# EAGLE design 2in-2out_1.0a (EAGLE 5.02)
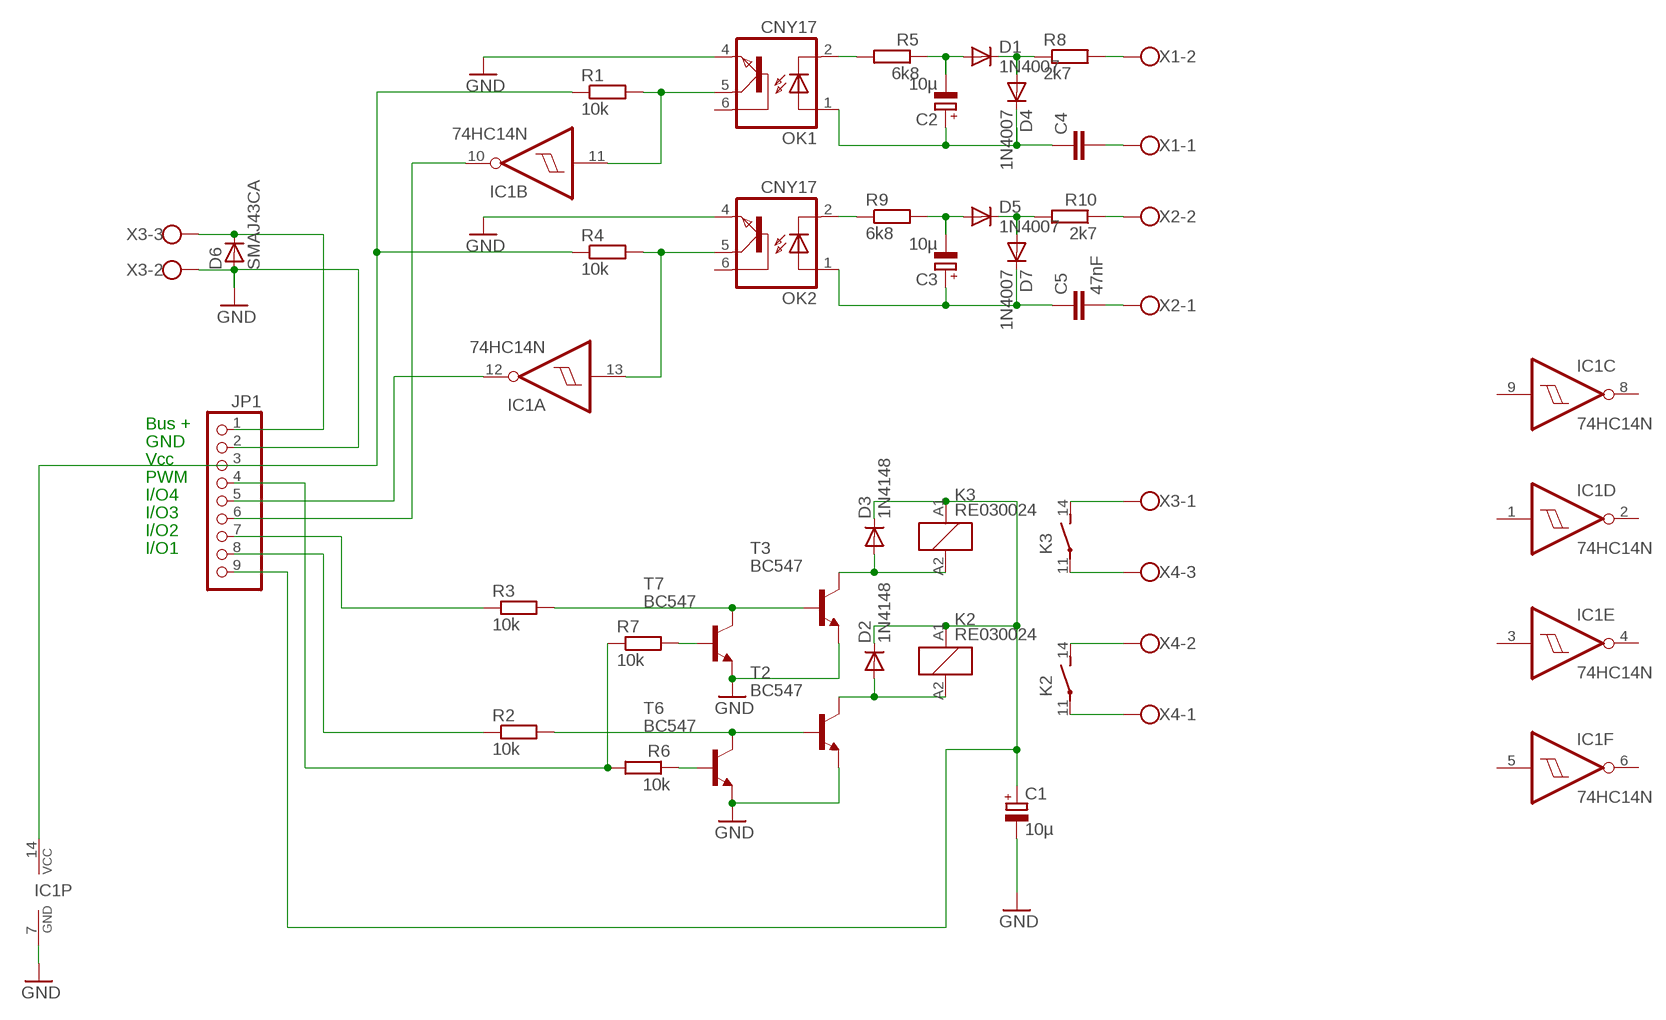
[diagram p0: schematic, sheet 1]

## Parts
C1  10µ  CPOL-EUE3.5-8  [E3,5-8]
C2  10µ  CPOL-EUE2-4  [E2-4]
C3  10µ  CPOL-EUE2-4  [E2-4]
C4  C-EU075-063X106  [C075-063X106]
C5  47nF  C-EU075-063X106  [C075-063X106]
D1  1N4007  DIODE-D-2.5  [D-2.5]
D2  1N4148  1N4148STEHEND  [D-2.5]
D3  1N4148  1N4148STEHEND  [D-2.5]
D4  1N4007  DIODE-D-2.5  [D-2.5]
D5  1N4007  DIODE-D-2.5  [D-2.5]
D6  SMAJ43CA  D-SMB  [SMB]
D7  1N4007  DIODE-D-2.5  [D-2.5]
IC1  74HC14N  [DIL14]
JP1  PINHD-1X9  [1X09]
K2  RE030024  [RE-SCHRACK]
K3  RE030024  [RE-SCHRACK]
OK1  CNY17  [DIL06]
OK2  CNY17  [DIL06]
R1  10k  R-EU_0207/7  [0207/7]
R2  10k  R-EU_0207/2V  [0207/2V]
R3  10k  R-EU_0207/2V  [0207/2V]
R4  10k  R-EU_0207/2V  [0207/2V]
R5  6k8  R-EU_0207/2V  [0207/2V]
R6  10k  R-EU_0207/2V  [0207/2V]
R7  10k  R-EU_0207/2V  [0207/2V]
R8  2k7  R-EU_0207/2V  [0207/2V]
R9  6k8  R-EU_0207/2V  [0207/2V]
R10  2k7  R-EU_0207/2V  [0207/2V]
T2  BC547  [TO92]
T3  BC547  [TO92]
T6  BC547  [TO92]
T7  BC547  [TO92]
X1  W237-02P  [W237-132]
X2  W237-02P  [W237-132]
X3  W237-3E  [W237-3E]
X4  W237-3E  [W237-3E]

## Nets
GND: C1.- D6.2(A) IC1.7(P:GND) JP1.2 OK1.4(EMI) OK2.4(EMI) T2.1(E) T3.1(E) T6.1(E) T7.1(E) X3.2
IO1: JP1.8 R2.1
IO2: JP1.7 R3.1
IO3: IC1.10(B:O) JP1.6
IO4: IC1.12(A:O) JP1.5
N$1: OK1.2(C) R5.2
N$2: K3.14(2:S) X3.1
N$3: C2.- D1.A R5.1
N$4: D6.1(C) JP1.1 X3.3
N$5: D1.C D4.A R8.1
N$6: R8.2 X1.2
N$7: K3.11(2:P) X4.3
N$8: K2.14(2:S) X4.2
N$9: K2.11(2:P) X4.1
N$10: OK2.2(C) R9.1
N$11: C5.2 X2.1
N$12: JP1.4 R6.2 R7.1
N$13: C3.- D5.A R9.2
N$14: R3.2 T3.2(B) T7.3(C)
N$15: C4.2 X1.1
N$17: R2.2 T2.2(B) T6.3(C)
N$18: D5.C D7.A R10.2
N$19: D2.A K2.A2 T2.3(C)
N$20: C3.+ C5.1 D7.C OK2.1(A)
N$21: R7.2 T7.2(B)
N$22: R6.1 T6.2(B)
N$23: R10.1 X2.2
N$24: C2.+ C4.1 D4.C OK1.1(A)
N$28: IC1.13(A:I) OK2.5(COL) R4.2
N$29: IC1.11(B:I) OK1.5(COL) R1.2
N$30: IC1.14(P:VCC) JP1.3 R1.1 R4.1
R3: D3.A K3.A2 T3.3(C)
VDD_IN: C1.+ D2.C D3.C JP1.9 K2.A1 K3.A1
Unconnected: IC1.1(D:I) IC1.2(D:O) IC1.3(E:I) IC1.4(E:O) IC1.5(F:I) IC1.6(F:O) IC1.8(C:O) IC1.9(C:I) OK1.6(BAS) OK2.6(BAS)

## Notes on the sheet
- Bus +
- GND
- Vcc
- PWM
- I/O4
- I/O3
- I/O2
- I/O1

## Library data of the parts
C1-C3 = rcl:CPOL-EU: POLARIZED CAPACITOR, European symbol
C4 C5 = rcl:C-EU: CAPACITOR, European symbol
D1 D4 D5 D7 = diode:DIODE-: DIODE
D2 D3 = diode:1N4148: DIODE high speed (Philips)
D6 = semicon-smd-ipc:D-: DIODE unfilled
IC1 = 74xx-eu:74*14: Hex schmitt trigger INVERTER
JP1 = pinhead:PINHD-1X9: PIN HEADER
K2 K3 = relay:RE03*: Miniature PCB Relay 1 pole 6 A SCHRACK Source: http://www.schrack.com/.. 5812.pdf
OK1 OK2 = optocoupler:CNY17: SIEMENS OPTO COUPLER
R1-R10 = rcl:R-EU_: RESISTOR, European symbol
T2 T3 T6 T7 = transistor-npn:BC547*: NPN Transistor
X1 X2 = con-wago-508:W237-02P: WAGO SREW CLAMP
X3 X4 = con-wago-508:W237-3E: WAGO SREW CLAMP

## Board
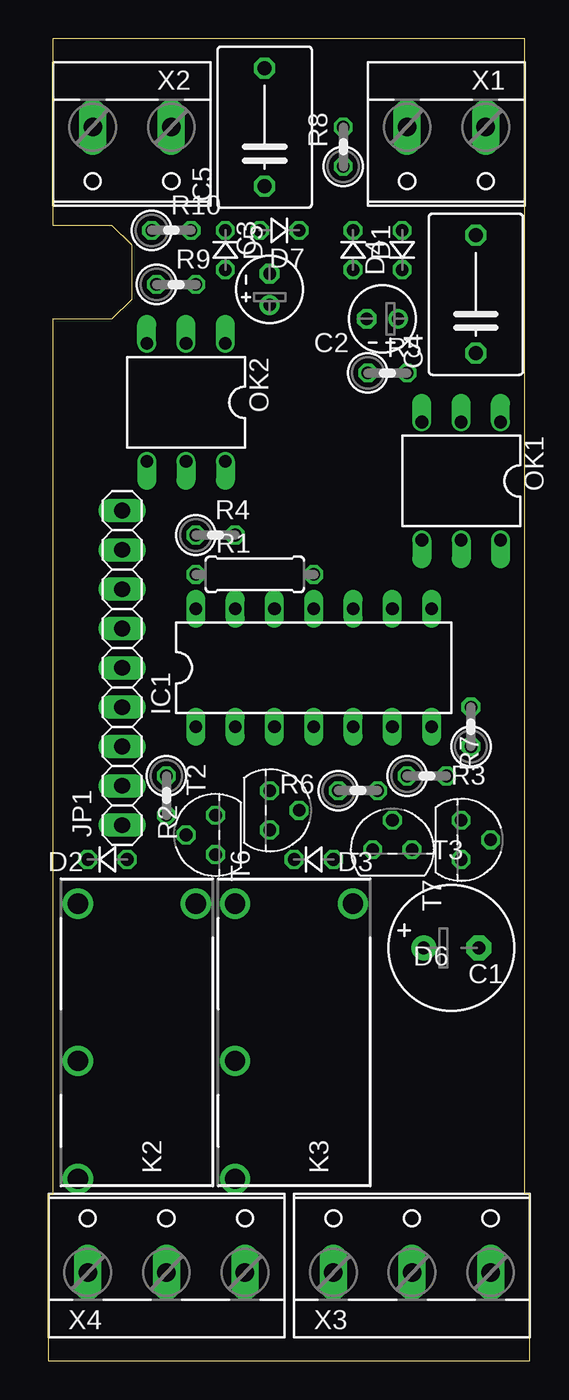
[diagram p1: board, top side]
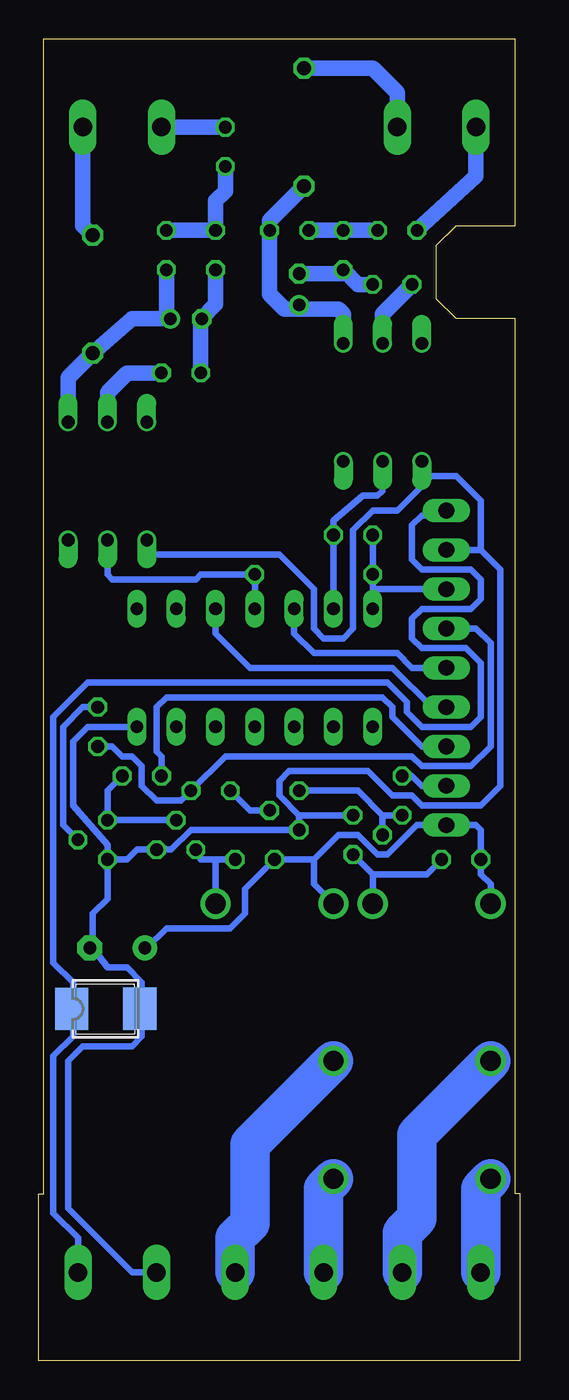
[diagram p2: board, bottom side, seen from below]

Size 31.11 x 85.41 mm. Coordinates in mm from the lower left corner, seen from the top.
Outline: 0,0 0,10.79 0.32,10.79 0.32,67.31 4.13,67.31 5.4,68.58 5.4,72.07 4.13,73.34 0.32,73.34 0.32,85.41 30.8,85.41 30.8,10.79 31.11,10.79 31.11,0 0,0
Copper layers (1*16): Top 0.035mm / dielectric 1.5mm / Bottom 0.035mm
Design rules "ZWILLING": minimum track width 0.2mm, minimum drill 0.5mm, track to track 0.2mm, track to pad 0.2mm, pad to pad 0.2mm, via to via 0.2mm, smd to smd 0mil, copper to edge 0.2mm, drill to drill 0.2mm, minimum pad ring 0.2mm, minimum via ring 0.2mm, stop-mask expansion 0.1mm, vias tented up to drill 0mil, thermal gap 10mil

### Footprints (pad centres in the part's own frame; a part is rotated, then mirrored left to right if it is on the bottom)
E3,5-8 = drill 0.813 pad 1.6 round: + -1.778,0 | drill 0.813 pad 1.6 octagon: - 1.778,0
E2-4 = drill 0.813 pad 1.27 round: + -1.016,0 | drill 0.813 pad 1.27 octagon: - 1.016,0
C075-063X106 = drill 0.914 octagon: 1 -3.81,0; 2 3.81,0
D-2.5 = drill 0.813 octagon: A 1.27,0; C -1.27,0
SMB = smd 2.159 x 2.743: 1 -2.311,-0.127; 2 2.108,-0.102
DIL14 = drill 0.813 long: 1 -7.62,-3.81; 2 -5.08,-3.81; 3 -2.54,-3.81; 4 0,-3.81; 5 2.54,-3.81; 6 5.08,-3.81; 7 7.62,-3.81; 8 7.62,3.81; 9 5.08,3.81; 10 2.54,3.81; 11 0,3.81; 12 -2.54,3.81; 13 -5.08,3.81; 14 -7.62,3.81
1X09 = drill 1.016 long: 1 -10.16,0; 2 -7.62,0; 3 -5.08,0; 4 -2.54,0; 5 0,0; 6 2.54,0; 7 5.08,0; 8 7.62,0; 9 10.16,0
RE-SCHRACK = drill 1.3 round: 11 8.89,-3.81; 14 1.27,-3.81; A1 -8.89,-3.81; A2 -8.89,3.81
DIL06 = drill 0.813 offset: 1 -2.54,-3.81; 2 0,-3.81; 3 2.54,-3.81; 4 2.54,3.81; 5 0,3.81; 6 -2.54,3.81
0207/7 = drill 0.813 octagon: 1 -3.81,0; 2 3.81,0
0207/2V = drill 0.813 octagon: 1 -1.27,0; 2 1.27,0
TO92 = drill 0.813 octagon: 1 1.27,0; 2 0,1.905; 3 -1.27,0
W237-132 = drill 1.194 long: 1 -2.54,-0.635; 2 2.54,-0.635
W237-3E = drill 1.194 long: 1 -5.08,-0.635; 2 0,-0.635; 3 5.08,-0.635

### Placement (x,y rotation side)
C1  26.04,26.67 0 top
C2  21.59,67.31 180 top
C3  14.29,69.22 90 top
C4  27.62,68.9 90 top
C5  13.97,79.69 90 top
D1  19.68,71.75 270 top
D2  3.81,32.38 0 top
D3  17.14,32.38 0 top
D4  22.86,71.75 90 top
D5  11.43,71.75 270 top
D6  26.67,22.86 0 bottom
D7  14.92,73.02 180 top
IC1  17.14,44.77 0 top
JP1  4.76,44.77 270 top
K2  5.71,20.64 270 top
K3  15.88,20.64 270 top
OK1  26.67,56.83 180 top
OK2  8.89,61.91 180 top
R1  13.34,50.8 0 top
R2  7.62,36.51 270 top
R3  24.45,37.78 0 top
R4  10.79,53.34 0 top
R5  21.91,63.82 0 top
R6  20,36.83 0 top
R7  27.3,40.96 90 top
R8  19.05,78.42 90 top
R9  8.26,69.53 0 top
R10  7.94,73.02 0 top
T2  10.79,33.97 90 top
T3  22.22,33.02 0 top
T6  14.29,35.56 270 top
T7  26.67,33.66 270 top
X1  25.72,79.06 180 top
X2  5.4,79.06 180 top
X3  23.49,6.35 0 top
X4  7.62,6.35 0 top

### Tracks (layer width: path | path; a pad name or v marks a point on that pad's centre or on a via)
GND
  Bottom 0.406: 14.29,35.24 14.29,34.92 | 14.29,35.24 T2.1 | T7.1 25.4,32.38 24.77,33.02 T3.1 22.54,33.02 21.27,34.29 T6.1 14.29,35.24 | T7.1 26.67,33.34 28.89,35.88 28.89,40 27.94,40.96 IC1.7 | OK1.4 24.13,52.07 15.56,52.07 13.34,49.85 13.34,47.31 12.7,46.67 11.43,46.67 10.79,47.31 10.79,53.66 9.52,54.93 7.94,54.93 6.35,56.52 6.35,57.15 | 27.62,26.67 27.62,28.89 26.67,29.85 T7.1 | 6.35,57.15 4.13,57.15 2.54,55.56 2.54,52.39 | 2.54,52.39 JP1.2 | X3.2 25.08,5.71 29.21,9.84 29.21,19.37 28.26,20.32 25.08,20.32 24.45,20.96 24.45,23.08 | 24.45,23.08 D6.2 | 24.45,23.08 24.45,24.45 25.4,25.4 26.67,25.4 27.62,26.67 | 27.62,26.67 C1.- | 2.54,52.39 1.27,51.12 1.27,37.15 2.54,35.88 6.35,35.88 6.99,36.51 8.26,36.51 9.84,38.1 14.92,38.1 15.56,37.46 15.56,36.51 14.29,35.24 | 6.35,57.15 OK2.4
IO1
  Bottom 0.406: JP1.8 6.35,37.15 6.99,37.78 R2.1
IO2
  Bottom 0.406: R3.1 23.18,39.05 23.49,39.37 23.49,42.23 22.86,42.86 8.89,42.86 8.26,42.23 8.26,41.59 6.35,39.69 JP1.7
IO3
  Bottom 0.406: IC1.10 19.68,46.99 17.46,44.77 8.26,44.77 5.71,42.23 JP1.6
IO4
  Bottom 0.406: IC1.12 14.6,46.99 13.34,45.72 7.94,45.72 6.99,44.77 JP1.5
N$1
  Bottom 1.016: R5.2 25.4,63.82 26.67,62.55 OK1.2
N$2
  Bottom 2.54: X3.1 18.42,7.94 17.46,8.89 17.46,13.97 K3.14
N$3
  Bottom 0.406: 20.64,66.99 C2.-
  Bottom 1.016: R5.1 20.64,66.99 | C2.- 19.68,68.26 D1.A
N$4
  Bottom 0.406: X3.3 28.58,7.94 30.16,9.52 30.16,19.69 28.89,20.96 28.89,23.05 | 28.89,23.05 D6.1 | 28.89,23.05 28.89,24.45 30.16,25.72 30.16,41.59 27.94,43.81 8.57,43.81 7.3,42.54 7.3,41.91 6.35,40.96 3.17,40.96 2.54,41.59 2.54,45.08 3.49,46.04 6.35,46.04 6.99,46.67 6.99,47.94 6.35,48.58 3.17,48.58 2.54,49.21 2.54,50.48 3.17,51.12 6.35,51.12 6.99,51.75 6.99,53.97 6.35,54.61 4.76,54.61 JP1.1
N$5
  Bottom 1.016: R8.1 19.05,75.56 19.68,74.93 D1.C D4.A
N$6
  Bottom 1.016: R8.2 X1.2
N$7
  Bottom 2.54: X4.3 12.7,11.11 K3.11
N$8
  Bottom 2.54: X4.2 7.62,8.25 6.67,9.21 6.67,14.61 K2.14
N$9
  Bottom 2.54: X4.1 2.54,11.11 K2.11
N$10
  Bottom 1.016: OK2.2 8.89,67.63 R9.1
N$11
  Bottom 1.016: X2.1 7.94,81.91 9.52,83.5 C5.2
N$12
  Bottom 0.406: R7.1 26.35,39.69 25.72,39.05 25.08,39.05 24.45,38.42 24.45,37.15 23.49,36.2 21.91,36.2 R6.2 19.05,39.05 6.99,39.05 6.35,38.42 3.17,38.42 1.9,39.69 1.9,46.35 2.86,47.31 JP1.4
N$13
  Bottom 0.406: D5.A 11.43,70.23
  Bottom 1.016: 11.43,70.23 C3.- | R9.2 10.48,69.53 D5.A
N$14
  Bottom 0.406: R3.2 26.67,36.83 T7.3 T3.2
N$15
  Bottom 1.016: X1.1 28.26,73.34 C4.2
N$17
  Bottom 0.406: 8.89,35.24 10.48,36.83 T6.3 | 8.89,35.24 T2.2 | R2.2 8.89,35.24
N$18
  Bottom 1.016: R10.2 D5.C D7.A
N$19
  Bottom 0.406: D2.A 6.03,31.43 9.52,31.43 | 9.52,31.43 T2.3 | 9.52,31.43 K2.A2
N$20
  Bottom 0.406: C3.+ 14.6,68.26
  Bottom 1.016: C5.1 16.19,73.66 D7.C 16.19,68.9 15.24,67.94 14.29,67.94 | OK2.1 11.43,67.63 11.75,67.94 14.29,67.94 | 14.29,67.94 C3.+
N$21
  Bottom 0.406: T7.2 29.53,34.61 29.53,40.96 28.26,42.23 R7.2
N$22
  Bottom 0.406: T6.2 17.46,35.56 R6.1
N$23
  Bottom 1.016: X2.2 2.86,76.52 R10.1
N$24
  Bottom 1.016: OK1.1 29.21,63.5 C4.1 25.08,67.31 22.86,67.31 | 22.86,67.31 D4.C | 22.86,67.31 C2.+
N$28
  Bottom 0.406: OK2.5 8.89,56.2 9.21,55.88 10.16,55.88 12.07,54.29 R4.2 IC1.13
N$29
  Bottom 0.406: IC1.11 R1.2 20.64,50.8 20.95,50.48 26.35,50.48 26.67,50.8 OK1.5
N$30
  Bottom 0.406: JP1.3 9.52,49.85 | 9.52,49.85 IC1.14 | 9.52,49.85 R1.1 R4.1
R3
  Bottom 0.406: K3.A2 19.68,32.38 | 19.68,32.38 D3.A | 19.68,32.38 20.64,32.38 T3.3
VDD_IN
  Bottom 0.406: K2.A1 1.9,30.8 2.54,31.43 D2.C 2.54,34.29 2.86,34.61 JP1.9 6.67,34.61 8.57,32.7 9.21,32.7 10.48,33.97 11.75,33.97 13.34,32.38 | 13.34,32.38 13.34,30.8 K3.A1 | 13.34,32.38 D3.C 17.78,30.48 17.78,28.89 18.73,27.94 22.86,27.94 24.13,26.67 C1.+